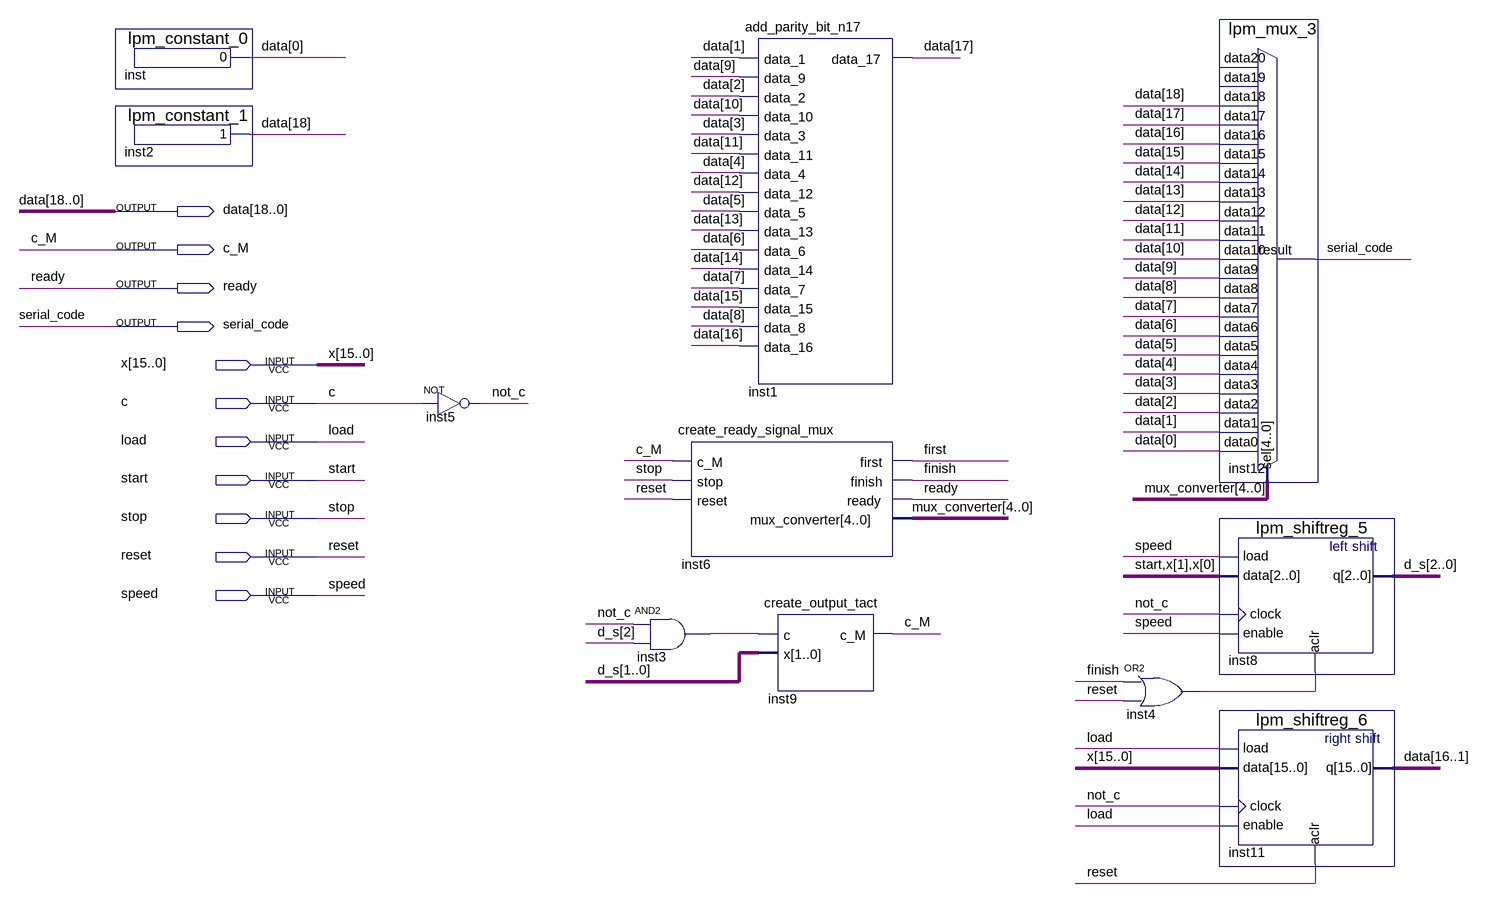
[diagram p0: schematic sheet]
// Quartus schematic create_serial_from_parallel_mux.bdf as structural Verilog: 11 symbols, 11 pins
module create_serial_from_parallel_mux (
  input  [15:0] x,
  input  c,
  input  load,
  input  start,
  input  stop,
  input  reset,
  input  speed,
  output [18:0] data,
  output c_M,
  output ready,
  output serial_code
);

  wire finish, first, inst3_out, inst4_out, not_c;
  wire [2:0] d_s;
  wire [4:0] mux_converter;

  lpm_constant_0 inst (.result(data[0]));
  lpm_constant_1 inst2 (.result(data[18]));
  not inst5 (not_c, c);
  and inst3 (inst3_out, not_c, d_s[2]);
  create_ready_signal_mux inst6 (
    .c_M(c_M), .stop(stop), .reset(reset), .first(first), .finish(finish), .ready(ready),
    .mux_converter(mux_converter));
  add_parity_bit_n17 inst1 (
    .data_1(data[1]), .data_9(data[9]), .data_2(data[2]), .data_10(data[10]), .data_3(data[3]),
    .data_11(data[11]), .data_4(data[4]), .data_12(data[12]), .data_5(data[5]), .data_13(data[13]),
    .data_6(data[6]), .data_14(data[14]), .data_7(data[7]), .data_15(data[15]), .data_8(data[8]),
    .data_16(data[16]), .data_17(data[17]));
  create_output_tact inst9 (.c(inst3_out), .x(d_s[1:0]), .c_M(c_M));
  or inst4 (inst4_out, finish, reset);
  lpm_mux_3 inst12 (
    .data18(data[18]), .data17(data[17]), .data16(data[16]), .data15(data[15]), .data14(data[14]),
    .data13(data[13]), .data12(data[12]), .data11(data[11]), .data10(data[10]), .data9(data[9]),
    .data8(data[8]), .data7(data[7]), .data6(data[6]), .data5(data[5]), .data4(data[4]), .data3(data[3]),
    .data2(data[2]), .data1(data[1]), .data0(data[0]), .sel(mux_converter), .result(serial_code));  // open: data20, data19
  lpm_shiftreg_5 inst8 (.load(speed), .data({start, x[1:0]}), .clock(not_c), .enable(speed), .aclr(inst4_out), .q(d_s));
  lpm_shiftreg_6 inst11 (.load(load), .data(x), .clock(not_c), .enable(load), .aclr(reset), .q(data[16:1]));
endmodule
